# Altium project IoT-Speaker-v1.4.PrjPcb (part 1 of 3)
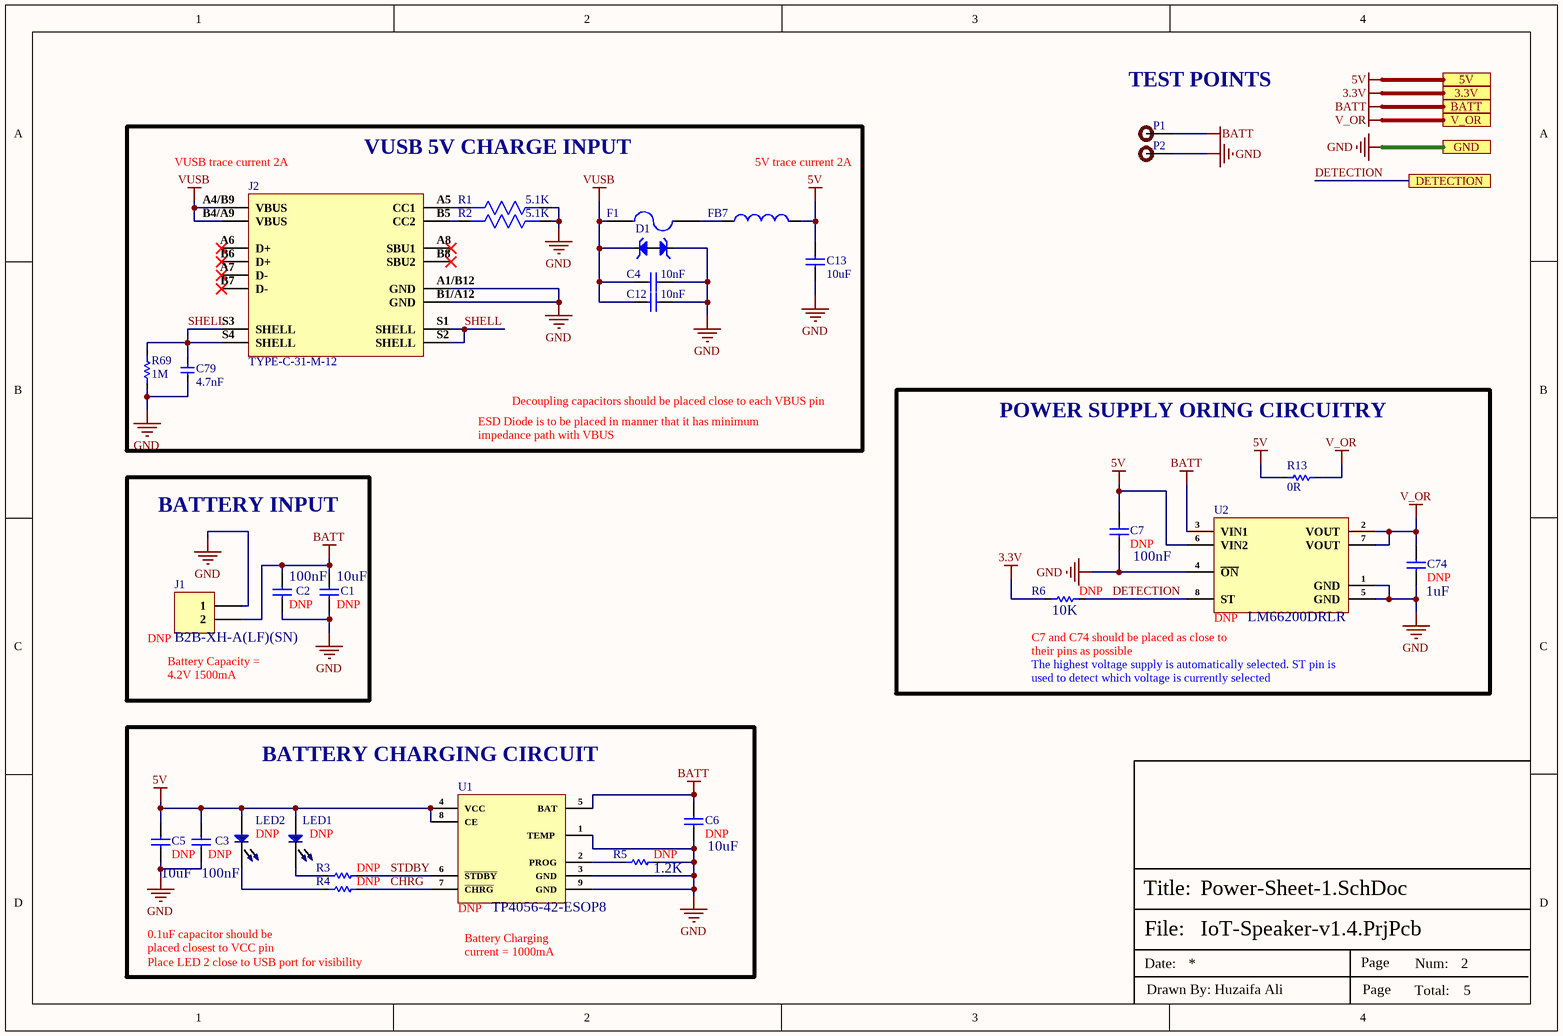
[diagram p0: Power-Sheet-1.SchDoc]
4 sheets, 113 parts. Net scope: strictly hierarchical (ports join the sheet entries above them; power ports are local).
Board file: IOT_Speaker-PCB-v1.4.PcbDoc
Sheets:
  Power-Sheet-1.SchDoc
  Power-Sheet-2.SchDoc
  Controller-Sheet.SchDoc
  Audio-Amplifier.SchDoc

## Sheet Power-Sheet-1.SchDoc
size A4; DocumentNumber: 2; SheetNumber: 2; SheetTotal: 5

### Parts
C1  DNP  [Cap-0805]
C2  DNP  [Cap-0402]
C3  DNP  [Cap-0402]
C4  10nF  [Cap-0603]
C5  DNP  [Cap-0805]
C6  DNP  [Cap-0805]
C7  DNP  [Cap-0402]
C12  10nF  [Cap-0603]
C13  10uF  [Cap-0805]
C74  DNP  [Cap-0603]
C79  4.7nF  [Cap-1206]
D1  PESD5V0H1BSFYL  [DSN0603-2]  (value not drawn)
F1  BSMD0805L-200  [Fuse-0805]  (value not drawn)
FB7  100MHz  [IND-1206]  (value not drawn)
J1  DNP  [B2B-XH-A(LF)(SN)_]
J2  TYPE-C-31-M-12  [TYPE-C-31-M-12_]
LED1  DNP  [LED-0603]
LED2  DNP  [LED-0603]
P1  TEST POINT  [Test-point]  (value not drawn)  (no BOM)
P2  TEST POINT  [Test-point]  (value not drawn)  (no BOM)
R1  5.1K  [Res-0603]
R2  5.1K  [Res-0603]
R3  DNP  [Res-0603]  (no BOM)
R4  DNP  [Res-0603]
R5  DNP  [Res-0603]
R6  DNP  [Res-0603]
R13  0R  [Res-0603]
R69  1M  [Res-0603]
U1  DNP  [ESOP-8]
U2  DNP  [SOT-583]

### Blocks framed on the sheet
VUSB 5V CHARGE INPUT: C4 C12 C13 C79 D1 F1 FB7 J2 R1 R2 R69
POWER SUPPLY ORING CIRCUITRY: C7 C74 R6 R13 U2
BATTERY INPUT: C1 C2 J1
BATTERY CHARGING CIRCUIT: C3 C5 C6 LED1 LED2 R3-R5 U1

### Ports
3.3V, 5V, BATT, DETECTION, GND, V_OR

### Nets
3.3V: R6.1 ; port 3.3V
5V: C3.2 C5.2 C7.2 C13.2 FB7.2 LED1.1 LED2.1 R13.1 U1.4(VCC) U1.8(CE) U2.6(VIN2) ; port 5V
BATT: C1.2 C2.2 C6.2 J1.2 P1.1 U1.5(BAT) U2.3(VIN1) ; port BATT
GND: C1.1 C2.1 C3.1 C4.2 C5.1 C6.1 C7.1 C12.2 C13.1 C74.1 C79.1 D1.2 J1.1 J2.A1/B12(GND) J2.B1/A12(GND) P2.1 R1.1 R2.1 R5.1 R69.1 U1.1(TEMP) U1.3(GND) U1.9(GND) U2.1(GND) U2.4(~{ON}) U2.5(GND) ; port GND
V_OR: C74.2 R13.2 U2.2(VOUT) U2.7(VOUT) ; port V_OR
VUSB: C4.1 C12.1 D1.1 F1.1 J2.A4/B9(VBUS) J2.B4/A9(VBUS)
CHRG: R4.2 U1.7(~{CHRG})
DETECTION: R6.2 U2.8(ST) ; port DETECTION
SHELL: C79.2 J2.S1(SHELL) J2.S2(SHELL) J2.S3(SHELL) J2.S4(SHELL) R69.2
STDBY: R3.2 U1.6(~{STDBY})
NetF1_2: F1.2 FB7.1
NetJ2_A5: J2.A5(CC1) R1.2
NetJ2_B5: J2.B5(CC2) R2.2
NetLED1_2: LED1.2 R3.1
NetLED2_2: LED2.2 R4.1
NetR5_2: R5.2 U1.2(PROG)

Not connected (* = marked no-connect by the designer): J2 A6(D+)* A7(D-)* A8(SBU1)* B6(D+)* B7(D-)* B8(SBU2)*

### Notes on the sheet
- TEST POINTS
- (near J2) VUSB trace current 2A
- 5V trace current 2A
- ESD Diode is to be placed in manner that it has minimum impedance path with VBUS
- Decoupling capacitors should be placed close to each VBUS pin
- 100nF
- (near C1) 10uF
- (near C7) 100nF
- (near J1) B2B-XH-A(LF)(SN)
- C7 and C74 should be placed as close to their pins as possible
- (near R6) 10K
- (near U2) LM66200DRLR
- (near C74) 1uF
- (near J1) Battery Capacity = 4.2V 1500mA
- The highest voltage supply is automatically selected. ST pin is used to detect which voltage is currently selected
- (near C6) 10uF
- 10uF
- (near LED2) 100nF
- (near U1) TP4056-42-ESOP8
- (near R5) 1.2K
- 0.1uF capacitor should be placed closest to VCC pin
- Place LED 2 close to USB port for visibility
- (near U1) Battery Charging current = 1000mA
- File:
- Title:
- Date:
- Page
- Num:
- Total:
- Drawn By: Huzaifa Ali

### Library data of the parts
C1 C13 = CC0805KKX5R8BB106: CAP CER 10UF 25V X5R 0805; Manufacturer: Yageo; Tolerance: 10%; Supplier 1: Digi-Key; Manufacturer Part Number: CC0805KKX5R8BB106; RoHS: Yes; Category: Ceramic Capacitors; Stock 1: 554290; Pricing 1: 1=0.31000, 10=0.21200, 50=0.14820, 100=0.12710, 500=0.09534, 1000=0.08050 (USD); Mount: Surface Mount; Case/Package: 0805; Case Code (Imperial): 0805; Case Code (Metric): 2012; Weight: 0.000194oz; Min Operating Temperature: -55°C; Max Operating Temperature: 85°C; Capacitance: 10uF; Voltage Rating (DC): 25V; Packaging: Tape and Reel; Voltage Rating: 25V; Dielectric: X5R; Termination: SMD/SMT; Resistor Type: Ceramic; Series: CC; Length: 0.079inch; Width: 0.049inch; Thickness: 0.057inch; Depth: 1.25mm; Lead Free: Lead Free; Halogen Free: Halogen Free; RoHS Compliant: Yes; ComponentLink1URL: http://www.mouser.com/ds/2/447/UPY-GPHC_X5R_4V-to-50V_25-1131599.pdf?src-supplier=Mouser; ComponentLink1Description: http://www.mouser.com/ds/2/447/UPY-GPHC_X5R_4V-to-50V_25-1131599.pdf?src-supplier=Mouser; ComponentLink2URL: http://www.yageo.com/documents/recent/UPY-GPHC_X5R_4V-to-50V_25.pdf?src-supplier=Digi-Key; ComponentLink2Description: http://www.yageo.com/documents/recent/UPY-GPHC_X5R_4V-to-50V_25.pdf?src-supplier=Digi-Key; Supplier Part Number 1: 311-1869-1-ND; LCSC Part Number: C89831
C2 C3 C7 = CC0402KRX5R8BB104: CAP CER 0.1UF 25V X5R 0402; Manufacturer: Yageo; Tolerance: 10%; Capacitance: 100nF; Item Type: Capacitor; Supplier 1: Digi-Key; Manufacturer Part Number: CC0402KRX5R8BB104; RoHS: Yes; Category: Ceramic Capacitors; Stock 1: 4598218; Pricing 1: 1=0.10000, 10=0.03800, 50=0.02100, 100=0.01710, 500=0.01224, 1000=0.00961, 2500=0.00874, 5000=0.00804 (USD); Mount: Surface Mount; Case/Package: 0402; Case Code (Metric): 1005; Case Code (Imperial): 0402; Min Operating Temperature: -55°C; Max Operating Temperature: 85°C; Voltage Rating: 25V; Packaging: Tape and Reel; Voltage Rating (DC): 25V; Dielectric: X5R; Resistor Type: Ceramic; Series: CC; Length: 0.039inch; Width: 0.02inch; Thickness: 0.022inch; Depth: 0.5mm; Lead Free: Lead Free; Halogen Free: Halogen Free; RoHS Compliant: Yes; ComponentLink1URL: http://www.mouser.com/ds/2/447/UPY-GPHC_X5R_4V-to-50V_25-1131599.pdf?src-supplier=Mouser; ComponentLink1Description: http://www.mouser.com/ds/2/447/UPY-GPHC_X5R_4V-to-50V_25-1131599.pdf?src-supplier=Mouser; ComponentLink2URL: http://www.yageo.com/documents/recent/UPY-GPHC_X5R_4V-to-50V-16.pdf?src-supplier=Future+Electronics; ComponentLink2Description: http://www.yageo.com/documents/recent/UPY-GPHC_X5R_4V-to-50V-16.pdf?src-supplier=Future+Electronics; ComponentLink3URL: http://www.yageo.com/documents/recent/UPY-GPHC_X5R_4V-to-50V_25.pdf?src-supplier=Digi-Key; ComponentLink3Description: http://www.yageo.com/documents/recent/UPY-GPHC_X5R_4V-to-50V_25.pdf?src-supplier=Digi-Key; Supplier Part Number 1: 311-1697-1-ND; LCSC Part Number: C106256
C4 C12 = CC0603JRNPO9BN103: CAP CER 10000PF 50V C0G/NPO 0603; Manufacturer: Yageo; Tolerance: 5%; Item Type: Capacitor; Supplier 1: Arrow Electronics; Manufacturer Part Number: CC0603JRNPO9BN103; RoHS: Yes; Category: Ceramic Capacitors; Stock 1: 5425; Pricing 1: 1=0.42340, 10=0.29770, 25=0.25590, 100=0.19550, 250=0.19360, 500=0.14320, 1000=0.12060, 3000=0.11930 (USD); Mount: Surface Mount; Case/Package: 0603; Min Operating Temperature: -55°C; Max Operating Temperature: 125°C; Packaging: Tape and Reel; Capacitance: 10nF; Voltage Rating: 50V; Length: 0.063inch; Width: 0.031inch; Thickness: 0.035inch; RoHS Compliant: Yes; ComponentLink1URL: http://www.yageo.com/documents/recent/UPY-GP_NP0_16V-to-50V_16.pdf?src-supplier=Digi-Key; ComponentLink1Description: http://www.yageo.com/documents/recent/UPY-GP_NP0_16V-to-50V_16.pdf?src-supplier=Digi-Key; ComponentLink2URL: http://www.yageo.com/exep/pages/download/literatures/ProductSelectionGuide%202014_Final_2.pdf?src-supplier=Digi-Key; ComponentLink2Description: http://www.yageo.com/exep/pages/download/literatures/ProductSelectionGuide%202014_Final_2.pdf?src-supplier=Digi-Key; Supplier Part Number 1: CC0603JRNPO9BN103; LCSC Part Number: C389113
C5 C6 = CC0805KKX5R8BB106: CAP CER 10UF 25V X5R 0805; Manufacturer: Yageo; Tolerance: 10%; Item Type: Capacitor; Supplier 1: Digi-Key; Manufacturer Part Number: CC0805KKX5R8BB106; RoHS: Yes; Category: Ceramic Capacitors; Stock 1: 554290; Pricing 1: 1=0.31000, 10=0.21200, 50=0.14820, 100=0.12710, 500=0.09534, 1000=0.08050 (USD); Mount: Surface Mount; Case/Package: 0805; Case Code (Imperial): 0805; Case Code (Metric): 2012; Weight: 0.000194oz; Min Operating Temperature: -55°C; Max Operating Temperature: 85°C; Capacitance: 10uF; Voltage Rating (DC): 25V; Packaging: Tape and Reel; Voltage Rating: 25V; Dielectric: X5R; Termination: SMD/SMT; Resistor Type: Ceramic; Series: CC; Length: 0.079inch; Width: 0.049inch; Thickness: 0.057inch; Depth: 1.25mm; Lead Free: Lead Free; Halogen Free: Halogen Free; RoHS Compliant: Yes; ComponentLink1URL: http://www.mouser.com/ds/2/447/UPY-GPHC_X5R_4V-to-50V_25-1131599.pdf?src-supplier=Mouser; ComponentLink1Description: http://www.mouser.com/ds/2/447/UPY-GPHC_X5R_4V-to-50V_25-1131599.pdf?src-supplier=Mouser; ComponentLink2URL: http://www.yageo.com/documents/recent/UPY-GPHC_X5R_4V-to-50V_25.pdf?src-supplier=Digi-Key; ComponentLink2Description: http://www.yageo.com/documents/recent/UPY-GPHC_X5R_4V-to-50V_25.pdf?src-supplier=Digi-Key; Supplier Part Number 1: 311-1869-1-ND; LCSC Part Number: C89831
C74 = CC0603KRX5R8BB105: CAP CER 1UF 25V X5R 0603; Manufacturer: Yageo; Tolerance: 10%; Item Type: Capacitor; Supplier 1: Digi-Key; Manufacturer Part Number: CC0603KRX5R8BB105; RoHS: Yes; Category: Ceramic Capacitors; Stock 1: 919939; Pricing 1: 1=0.12000, 10=0.08400, 50=0.04760, 100=0.03940, 500=0.02764, 1000=0.02288 (USD); Mount: Surface Mount; Case/Package: 0603; Number of Pins: 2; Case Code (Metric): 1608; Case Code (Imperial): 0603; Min Operating Temperature: -55°C; Max Operating Temperature: 85°C; Capacitance: 1uF; Dielectric: X5R; Package Quantity: 1; Voltage Rating: 25V; Packaging: Tape and Reel; Termination: SMD/SMT; Voltage Rating (DC): 25V; Series: CC; Construction: Flat; Length: 1.6mm; Width: 0.031inch; Height: 0.8mm; Thickness: 0.035inch; Depth: 0.8mm; Radiation Hardening: No; REACH SVHC: No SVHC; Lead Free: Lead Free; Halogen Free: Halogen Free; RoHS Compliant: Yes; ComponentLink1URL: https://datasheet.ciiva.com/176/mlccorderingcode-176785.pdf?src-supplier=Digi-Key; ComponentLink1Description: https://datasheet.ciiva.com/176/mlccorderingcode-176785.pdf?src-supplier=Digi-Key; ComponentLink2URL: https://datasheet.ciiva.com/176/mlccorderingcode-176786.pdf?src-supplier=Digi-Key; ComponentLink2Description: https://datasheet.ciiva.com/176/mlccorderingcode-176786.pdf?src-supplier=Digi-Key; ComponentLink3URL: https://datasheet.ciiva.com/176/mlccorderingcode-176787.pdf?src-supplier=Digi-Key; ComponentLink3Description: https://datasheet.ciiva.com/176/mlccorderingcode-176787.pdf?src-supplier=Digi-Key; ComponentLink4URL: https://datasheet.ciiva.com/17436/upy-gphc-x5r-4v-to-50v-12-17436952.pdf?src-supplier=Avnet+Europe; ComponentLink4Description: https://datasheet.ciiva.com/17436/upy-gphc-x5r-4v-to-50v-12-17436952.pdf?src-supplier=Avnet+Europe; ComponentLink5URL: https://datasheet.ciiva.com/7978/1525783-7978171.pdf?src-supplier=Element14; ComponentLink5Description: https://datasheet.ciiva.com/7978/1525783-7978171.pdf?src-supplier=Element14; ComponentLink6URL: https://datasheet.ciiva.com/11586/upy-gphc-x5r-4v-to-50v-12-11586318.pdf?src-supplier=Avnet; ComponentLink6Description: https://datasheet.ciiva.com/11586/upy-gphc-x5r-4v-to-50v-12-11586318.pdf?src-supplier=Avnet; Supplier Part Number 1: 311-1445-1-ND; LCSC Part Number: C14664
C79 = CC1206KKX7RCBB472: CAP CER 4700PF 1KV X7R 1206; Manufacturer: Yageo; Dielectric Material: Ceramic; Tolerance: 10%; Item Type: Capacitor; Supplier 1: Future Electronics; Manufacturer Part Number: CC1206KKX7RCBB472; RoHS: Yes; Category: Ceramic Capacitors; Stock 1: 180000; Pricing 1: 3000=0.02860, 9000=0.02750, 15000=0.02700, 45000=0.02600, 75000=0.02510 (USD); Mount: Surface Mount; Case/Package: 1206; Number of Pins: 2; Case Code (Imperial): 1206; Case Code (Metric): 3216; Weight: 0.000571oz; Min Operating Temperature: -55°C; Max Operating Temperature: 125°C; Voltage Rating: 1kV; Capacitance: 4.7nF; Packaging: Tape and Reel; Voltage Rating (DC): 1kV; Dielectric: X7R; Termination: SMD/SMT; Resistor Type: Ceramic; Series: CC; Length: 3.2mm; Width: 0.063inch; Thickness: 0.057inch; Depth: 1.6mm; Radiation Hardening: No; Lead Free: Lead Free; RoHS Compliant: Yes; ComponentLink1URL: https://datasheet.ciiva.com/13208/upy-gp-np0-16v-to-50v-8-13208693.pdf?src-supplier=Mouser; ComponentLink1Description: https://datasheet.ciiva.com/13208/upy-gp-np0-16v-to-50v-8-13208693.pdf?src-supplier=Mouser; ComponentLink2URL: https://datasheet.ciiva.com/11466/hv-11466701.pdf?src-supplier=Avnet; ComponentLink2Description: https://datasheet.ciiva.com/11466/hv-11466701.pdf?src-supplier=Avnet; Supplier Part Number 1: 7130131; LCSC Part Number: C107198
D1 = PESD5V0H1BSFYL: TVS DIODE 5VWM 6.3VC DSN0603-2; Manufacturer: Nexperia; Supplier 1: Avnet; Manufacturer Part Number: PESD5V0H1BSFYL; RoHS: Yes; Category: ESD and Circuit Protection ICs; Stock 1: 9000; Pricing 1: 18000=0.06453, 36000=0.06278, 54000=0.06104, 90000=0.05930, 180000=0.05755, 900000=0.05581, 1800000=0.05406 (USD); RoHS Compliant: Yes; ComponentLink1URL: http://www.farnell.com/datasheets/1961312.pdf?src-supplier=Farnell; ComponentLink1Description: http://www.farnell.com/datasheets/1961312.pdf?src-supplier=Farnell; ComponentLink2URL: https://assets.nexperia.com/documents/data-sheet/PESD5V0H1BSF.pdf?src-supplier=Digi-Key; ComponentLink2Description: https://assets.nexperia.com/documents/data-sheet/PESD5V0H1BSF.pdf?src-supplier=Digi-Key; ComponentLink3URL: http://www.farnell.com/datasheets/1961312.pdf?src-supplier=Newark; ComponentLink3Description: http://www.farnell.com/datasheets/1961312.pdf?src-supplier=Newark; Supplier Part Number 1: PESD5V0H1BSFYL; LCSC Part Number: C477989; Item Type: Diode
F1 = BSMD0805L-200: 6V 2A 50A 1W -40℃~+85℃ 4A 4mΩ 5s 45mΩ 0805 Resettable Fuses ROHS; Manufacturer: BHFUSE; Item Type: Fuse; Manufacturer Part Number: BSMD0805L-200; Package: 0805; LCSC Part Number: C2757931; ComponentLink1Description: LCSC; ComponentLink1URL: https://www.lcsc.com/product-detail/Resettable-Fuses_BHFUSE-BSMD0805L-200_C2757931.html
FB7 = BLM31PG121SN1L: FERRITE BEAD 120 OHM 1206 1LN; Manufacturer: Murata; Material: Steel,Ferrite; Tolerance: 25%; Impedance: 120R; Max Current Rating: 3.5A; Number of Lines: 1; DC Resistance (DCR): 20mR; Max DC Current: 3A; Shielding: Unshielded; Supplier 1: Avnet; Manufacturer Part Number: BLM31PG121SN1L; RoHS: Yes; Category: Ferrite Beads and Chips; Stock 1: 290640; Pricing 1: 3000=0.11563, 6000=0.10938, 12000=0.10313, 18000=0.09688, 24000=0.09063, 30000=0.08438, 300000=0.07813 (USD); Case/Package: 1206; Number of Pins: 2; Core Material: Ferrite; Case Code (Metric): 3216; Case Code (Imperial): 1206; Contact Plating: Tin,Matte; Min Operating Temperature: -55°C; Max Operating Temperature: 125°C; Package Quantity: 3000; Packaging: Tape and Reel; Current Rating: 3.5A; Termination: SMD/SMT; Test Frequency: 100MHz; DC Current: 3A; Frequency: 100MHz; Length: 3.2mm; Width: 1.6mm; Height: 1.1mm; Depth: 1.6mm; Radiation Hardening: No; Military Standard: Not; Lead Free: Lead Free; RoHS Compliant: Yes; ComponentLink1URL: https://datasheet.ciiva.com/19460/1845419-19460234.pdf?src-supplier=Jameco; ComponentLink1Description: https://datasheet.ciiva.com/19460/1845419-19460234.pdf?src-supplier=Jameco; ComponentLink2URL: https://datasheet.ciiva.com/1012/l0132s0193blm31p-1012992.pdf?src-supplier=Digi-Key; ComponentLink2Description: https://datasheet.ciiva.com/1012/l0132s0193blm31p-1012992.pdf?src-supplier=Digi-Key; ComponentLink3URL: https://datasheet.ciiva.com/11799/0900766b811b5866-11799444.pdf?src-supplier=RSComponents; ComponentLink3Description: https://datasheet.ciiva.com/11799/0900766b811b5866-11799444.pdf?src-supplier=RSComponents; ComponentLink4URL: https://datasheet.ciiva.com/3081/l0110s0100blm31p-3081665.pdf?src-supplier=Avnet; ComponentLink4Description: https://datasheet.ciiva.com/3081/l0110s0100blm31p-3081665.pdf?src-supplier=Avnet; ComponentLink5URL: https://datasheet.ciiva.com/41449/001172383-da-01-en-drossel-1206-120r-3-2x1-60mm-3000st-41449554.pdf?src-supplier=Conrad; ComponentLink5Description: https://datasheet.ciiva.com/41449/001172383-da-01-en-drossel-1206-120r-3-2x1-60mm-3000st-41449554.pdf?src-supplier=Conrad; ComponentLink6URL: https://datasheet.ciiva.com/29348/442557-da-01-en-chip-drossel-1206-120r-3000ma-3-2x1-60mm-29348014.pdf?src-supplier=Conrad; ComponentLink6Description: https://datasheet.ciiva.com/29348/442557-da-01-en-chip-drossel-1206-120r-3000ma-3-2x1-60mm-29348014.pdf?src-supplier=Conrad; ComponentLink7URL: https://datasheet.ciiva.com/14122/apblm31p-data-e-14122856.pdf?src-supplier=Distrelec; ComponentLink7Description: https://datasheet.ciiva.com/14122/apblm31p-data-e-14122856.pdf?src-supplier=Distrelec; ComponentLink8URL: https://datasheet.ciiva.com/48436/blm31pg121sn1l-eng-tds-48436731.pdf?src-supplier=Distrelec; ComponentLink8Description: https://datasheet.ciiva.com/48436/blm31pg121sn1l-eng-tds-48436731.pdf?src-supplier=Distrelec; ComponentLink9URL: https://datasheet.ciiva.com/1012/l0110s0100blm31p-1012991.pdf?src-supplier=Digi-Key; ComponentLink9Description: https://datasheet.ciiva.com/1012/l0110s0100blm31p-1012991.pdf?src-supplier=Digi-Key; ComponentLink10URL: https://datasheet.ciiva.com/1012/l0110s0100blm31p-1012993.pdf?src-supplier=Digi-Key; ComponentLink10Description: https://datasheet.ciiva.com/1012/l0110s0100blm31p-1012993.pdf?src-supplier=Digi-Key; ComponentLink11URL: https://datasheet.ciiva.com/3081/l0110s0100blm31p-3081666.pdf?src-supplier=Avnet; ComponentLink11Description: https://datasheet.ciiva.com/3081/l0110s0100blm31p-3081666.pdf?src-supplier=Avnet; ComponentLink12URL: https://datasheet.ciiva.com/16390/l0110s0100blm31p-16390857.pdf?src-supplier=Future+Electronics; ComponentLink12Description: https://datasheet.ciiva.com/16390/l0110s0100blm31p-16390857.pdf?src-supplier=Future+Electronics; ComponentLink13URL: https://datasheet.ciiva.com/18093/getdatasheetpartid-152966-18093084.pdf?src-supplier=Verical; ComponentLink13Description: https://datasheet.ciiva.com/18093/getdatasheetpartid-152966-18093084.pdf?src-supplier=Verical; Supplier Part Number 1: BLM31PG121SN1L; LCSC Part Number: C85841; Item Type: Ferrite Bead
J1 = B2B-XH-A(LF)(SN): Conn Shrouded Header (4 Sides) HDR 2 POS 2.5mm Solder ST Thru-Hole Box; Manufacturer: JST; Number of Positions: 2; Connector Type: Male Pin; Current Rating: 3A; Contact Resistance: 20mR; Voltage Rating: 250V; Insulation Resistance: 1GR; Wire/Cable Gauge: 22AWG; Item Type: JST Connector; Supplier 1: Farnell; Manufacturer Part Number: B2B-XH-A(LF)(SN); RoHS: Yes; Category: FFC / FPC; Stock 1: 219240; Pricing 1: 100=0.06860, 1000=0.04800, 2500=0.04520, 5000=0.04230, 10000=0.03950, 20000=0.03660 (GBP); Mount: Through Hole; Contact Plating: Tin,Copper,Lead; Color: Natural; Contact Material: Brass; Housing Color: White; Housing Material: Polyamide; Min Operating Temperature: -25°C; Max Operating Temperature: 85°C; Number of Rows: 1; Packaging: Bulk; Termination: Solder; Fastening Type: Detent; Max Current Rating: 3A; Voltage Rating (AC): 250V; Max Voltage Rating (AC): 250V; Number of Contacts: 2; Max Voltage Rating (DC): 250V; Orientation: Straight; Length: 7.4mm; Pitch: 2.5mm; Lead Pitch: 2.5mm; Depth: 5.75mm; REACH SVHC: No SVHC; Lead Free: Lead Free; ComponentLink1URL: https://datasheet.ciiva.com/26894/getdatasheetpartid-640357-26894434.pdf?src-supplier=Verical; ComponentLink1Description: https://datasheet.ciiva.com/26894/getdatasheetpartid-640357-26894434.pdf?src-supplier=Verical; ComponentLink2URL: https://datasheet.ciiva.com/11746/0900766b8082653e-11746979.pdf?src-supplier=RSComponents; ComponentLink2Description: https://datasheet.ciiva.com/11746/0900766b8082653e-11746979.pdf?src-supplier=RSComponents; ComponentLink3URL: https://datasheet.ciiva.com/26894/getdatasheetpartid-385291-26894760.pdf?src-supplier=Verical; ComponentLink3Description: https://datasheet.ciiva.com/26894/getdatasheetpartid-385291-26894760.pdf?src-supplier=Verical; ComponentLink4URL: https://datasheet.ciiva.com/8052/5448-8052024.pdf?src-supplier=Element14; ComponentLink4Description: https://datasheet.ciiva.com/8052/5448-8052024.pdf?src-supplier=Element14; ComponentLink5URL: https://datasheet.ciiva.com/20207/523653-20207167.pdf?src-supplier=Rapid+Electronics; ComponentLink5Description: https://datasheet.ciiva.com/20207/523653-20207167.pdf?src-supplier=Rapid+Electronics; Supplier Part Number 1: 1516276; LCSC Part Number: C158012
J2 = TYPE-C-31-M-12: 250mA 1 16 Female Type-C SMD USB Connectors ROHS; Manufacturer: Korean Hroparts Elec; ComponentLink1Description: LCSC; ComponentLink1URL: https://www.lcsc.com/product-detail/USB-Connectors_Korean-Hroparts-Elec-TYPE-C-31-M-12_C165948.html; Manufacturer Part Number: TYPE-C-31-M-12; Footprint: Custom; LCSC Part Number: C165948; Item Type: USB Connector
LED1 = NCD0603G2: Emerald 0603 Light Emitting Diodes (LED) ROHS; Manufacturer: Foshan NationStar Optoelectronics; Manufacturer Part Number: NCD0603G2; Package: 0603; LCSC Part Number: C87326; Item Type: LED; ComponentLink1Description: LCSC; ComponentLink1URL: https://www.lcsc.com/product-detail/Light-Emitting-Diodes-LED_Foshan-NationStar-Optoelectronics-NCD0603G2_C87326.html
LED2 = NCD0603R3: 0603 Light Emitting Diodes (LED) ROHS; Manufacturer: Foshan NationStar Optoelectronics; Manufacturer Part Number: NCD0603R3; Package: 0603; Item Type: LED; LCSC Part Number: C3151730; ComponentLink1Description: LCSC; ComponentLink1URL: https://www.lcsc.com/product-detail/Light-Emitting-Diodes-LED_Foshan-NationStar-Optoelectronics-NCD0603R3_C3151730.html
P1 P2 = TEST POINT: Test Point ON; Item Type: TEST POINT
R1 R2 = RC0603FR-075K1L: RES 5.1K OHM 1% 1/10W 0603; Manufacturer: Yageo; Power Rating: 100mW; Temperature Coefficient: 100ppm/°C; Resistance: 5.1kR; Voltage Rating: 50V; Item Type: Resistor; Supplier 1: Avnet; Manufacturer Part Number: RC0603FR-075K1L; RoHS: Yes; Category: Chip SMD Resistors; Stock 1: 100000; Pricing 1: 5000=0.00133, 10000=0.00131, 20000=0.00127 (USD); Case/Package: 0603; Number of Pins: 2; Case Code (Imperial): 0603; Case Code (Metric): 1608; Size Code: 0603; Min Operating Temperature: -55°C; Max Operating Temperature: 155°C; Tolerance: 1%; Series: RC; Packaging: Tape and Reel; Package Quantity: 1; Termination: SMD/SMT; Resistor Type: Thick Film; Number of Terminations: 2; Max Power Dissipation: 100mW; Voltage Rating (DC): 50V; Features: Moisture Resistant; Resistance Tolerance: 1%; Construction: Rectangular; Length: 0.063inch; Width: 0.031inch; Height: 0.022inch; Depth: 0.8mm; RoHS Compliant: Yes; Reach SVHC Compliant: Yes; Military Standard: Not; Lead Free: Lead Free; ComponentLink1URL: https://datasheet.ciiva.com/46395/443971-46395016.pdf?src-supplier=Element14; ComponentLink1Description: https://datasheet.ciiva.com/46395/443971-46395016.pdf?src-supplier=Element14; ComponentLink2URL: https://datasheet.ciiva.com/2454/pyu-r-int-thick-7-2454046.pdf?src-supplier=Digi-Key; ComponentLink2Description: https://datasheet.ciiva.com/2454/pyu-r-int-thick-7-2454046.pdf?src-supplier=Digi-Key; ComponentLink3URL: https://datasheet.ciiva.com/2454/pyu-r-int-thick-7-2454047.pdf?src-supplier=Digi-Key; ComponentLink3Description: https://datasheet.ciiva.com/2454/pyu-r-int-thick-7-2454047.pdf?src-supplier=Digi-Key; ComponentLink4URL: https://datasheet.ciiva.com/2454/pyu-r-int-thick-7-2454045.pdf?src-supplier=Digi-Key; ComponentLink4Description: https://datasheet.ciiva.com/2454/pyu-r-int-thick-7-2454045.pdf?src-supplier=Digi-Key; ComponentLink5URL: https://datasheet.ciiva.com/15189/getdatasheetpartid-326732-15189786.pdf?src-supplier=Verical; ComponentLink5Description: https://datasheet.ciiva.com/15189/getdatasheetpartid-326732-15189786.pdf?src-supplier=Verical; Supplier Part Number 1: RC0603FR-075K1L; LCSC Part Number: C105580
R3 = RC0603FR-07220RL: RES SMD 220 OHM 1% 1/10W 0603; Manufacturer: Yageo; Resistance: 220R; Temperature Coefficient: 100ppm/°C; Voltage Rating (DC): 50V; Power Rating: 100mW; Item Type: Resistor; Supplier 1: Digi-Key; Manufacturer Part Number: RC0603FR-07220RL; Stock 1: 5843995; Pricing 1: 1=0.1, 10=0.023, 100=0.0094, 1000=0.00421, 2500=0.00366 (USD); Case/Package: 0603; Number of Pins: 2; Case Code (Imperial): 0603; Case Code (Metric): 1608; Min Operating Temperature: -55°C; Max Operating Temperature: 155°C; Tolerance: 1%; Composition: Thick Film; Packaging: Tape and Reel; Voltage Rating: 50V; Package Quantity: 1; Termination: SMD/SMT; Number of Terminations: 2; Military Standard: Not; Max Power Dissipation: 100mW; Features: Moisture Resistant; Length: 1.6mm; Height: 0.022inch; Width: 0.031inch; Depth: 0.8mm; REACH SVHC: No SVHC; Lead Free: Lead Free; ComponentLink1URL: http://www.yageo.com/documents/recent/PYu-RC_Group_51_RoHS_L_10.pdf?src-supplier=Digi-Key; ComponentLink1Description: http://www.yageo.com/documents/recent/PYu-RC_Group_51_RoHS_L_10.pdf?src-supplier=Digi-Key; ComponentLink2URL: http://www.farnell.com/datasheets/1868787.pdf?src-supplier=Element14; ComponentLink2Description: http://www.farnell.com/datasheets/1868787.pdf?src-supplier=Element14; Supplier Part Number 1: 311-220HRCT-ND; LCSC Part Number: C107696
R4 = RC0603JR-07330RL: RES  SMD 330R 100 mW 0603; Manufacturer: Yageo; Power Rating: 100mW; Tolerance: 5%; Voltage Rating (DC): 50V; Temperature Coefficient: 100ppm/°C; Item Type: Resistor; Supplier 1: Digi-Key; Manufacturer Part Number: RC0603JR-07330RL; RoHS: Yes; Category: Chip SMD Resistors; Stock 1: 1074593; Pricing 1: 1=0.10000, 10=0.02000, 100=0.00800, 1000=0.00360, 2500=0.00312 (USD); Case/Package: 0603; Number of Pins: 2; Case Code (Imperial): 0603; Case Code (Metric): 1608; Size Code: 0603; Min Operating Temperature: -55°C; Max Operating Temperature: 155°C; Resistance: 330R; Packaging: Tape and Reel; Voltage Rating: 50V; Package Quantity: 5000; Termination: SMD/SMT; Resistor Type: Thick Film; Features: Moisture Resistant; Series: RC; Max Power Dissipation: 100mW; Number of Terminations: 2; Resistance Tolerance: 5%; Construction: Rectangular; Length: 1.6mm; Width: 0.8mm; Height: 0.45mm; Depth: 0.8mm; REACH SVHC: No SVHC; Lead Free: Lead Free; Military Standard: Not; RoHS Compliant: Yes; Supplier Part Number 1: 311-330GRCT-ND; LCSC Part Number: C105879
R5 = 0603WAF1201T5E: Thick Film Resistors 75V 1.2kΩ 0603 Chip Resistor - Surface Mount ROHS; Manufacturer: UNI-ROYAL; Footpint: 0603; Manufacturer Part Number: 0603WAF1201T5E; Value: 1.2kΩ; ComponentLink1Description: LCSC; ComponentLink1URL: https://lcsc.com/product-detail/Chip-Resistor-Surface-Mount_UNI-ROYAL-Uniroyal-Elec-0603WAF1201T5E_C22765.html; LCSC Part Number: C22765; Item Type: Resistor
R6 = RC0603FR-0710KL: RES SMD 10K Ohm 1% 1/10W 0603; Manufacturer: Yageo; Resistance: 10kR; Temperature Coefficient: 100ppm/°C; Voltage Rating (DC): 50V; Power Rating: 100mW; Voltage Rating: 75V; Item Type: Resistor; Supplier 1: Digi-Key; Manufacturer Part Number: RC0603FR-0710KL; RoHS: Yes; Category: Chip SMD Resistors; Stock 1: 25249139; Pricing 1: 1=0.10000, 10=0.02400, 100=0.00970, 1000=0.00436, 2500=0.00378 (USD); Case/Package: 0603; Number of Pins: 2; Case Code (Imperial): 0603; Case Code (Metric): 1608; Weight: 7.1E-05oz; Size Code: 0603; Min Operating Temperature: -55°C; Max Operating Temperature: 155°C; Tolerance: 1%; Resistor Type: Thick Film; Packaging: Tape and Reel; Termination: SMD/SMT; Features: Moisture Resistant; Series: RC; Max Power Dissipation: 100mW; Number of Terminations: 2; Resistance Tolerance: 1%; Construction: Rectangular; Length: 1.6mm; Width: 0.8mm; Height: 0.45mm; Depth: 0.8mm; Lead Pitch: 0.3mm; REACH SVHC: Unknown; Lead Free: Lead Free; Military Standard: Not; RoHS Compliant: Yes; ComponentLink1URL: https://datasheet.ciiva.com/7660/38590-7660789.pdf?src-supplier=Element14; ComponentLink1Description: https://datasheet.ciiva.com/7660/38590-7660789.pdf?src-supplier=Element14; ComponentLink2URL: https://datasheet.ciiva.com/7983/443971-7983596.pdf?src-supplier=Element14; ComponentLink2Description: https://datasheet.ciiva.com/7983/443971-7983596.pdf?src-supplier=Element14; ComponentLink3URL: https://datasheet.ciiva.com/22747/443971-22747519.pdf?src-supplier=Element14; ComponentLink3Description: https://datasheet.ciiva.com/22747/443971-22747519.pdf?src-supplier=Element14; ComponentLink4URL: https://datasheet.ciiva.com/46440/1868787-46440891.pdf?src-supplier=Element14; ComponentLink4Description: https://datasheet.ciiva.com/46440/1868787-46440891.pdf?src-supplier=Element14; ComponentLink5URL: https://datasheet.ciiva.com/7746/1738695-7746239.pdf?src-supplier=Element14; ComponentLink5Description: https://datasheet.ciiva.com/7746/1738695-7746239.pdf?src-supplier=Element14; ComponentLink6URL: https://datasheet.ciiva.com/15189/getdatasheetpartid-409289-15189591.pdf?src-supplier=Verical; ComponentLink6Description: https://datasheet.ciiva.com/15189/getdatasheetpartid-409289-15189591.pdf?src-supplier=Verical; Supplier Part Number 1: 311-10.0KHRCT-ND; LCSC Part Number: C98220
R13 = RC0603JR-070RL: RES 0 OHM JUMPER 1/10W 0603; Manufacturer: Yageo; Resistance: 0mR; Tolerance: 1%; Power Rating: 100mW; Voltage Rating (DC): 50V; Temperature Coefficient: 200ppm/°C; Resistance Tolerance: 5%; Item Type: Resistor; Supplier 1: Digi-Key; Manufacturer Part Number: RC0603JR-070RL; RoHS: Yes; Category: Chip SMD Resistors; Stock 1: 18081776; Pricing 1: 1=0.10000, 10=0.01700, 25=0.01240, 50=0.00960, 100=0.00700, 250=0.00536, 500=0.00430, 1000=0.00316 (USD); Case/Package: 0603; Number of Pins: 2; Contact Plating: Tin,Matte; Case Code (Imperial): 0603; Case Code (Metric): 1608; Size Code: 0603; Min Operating Temperature: -55°C; Max Operating Temperature: 155°C; Resistor Type: Thick Film; Packaging: Tape and Reel; Termination: SMD/SMT; Series: RC; Technology: THICK FILM; Package Quantity: 5000; Voltage Rating: 50V; Features: Moisture Resistant; Max Power Dissipation: 100mW; Number of Terminations: 2; Construction: Rectangular; Length: 1.6mm; Width: 0.8mm; Height: 0.45mm; Depth: 0.8mm; Radiation Hardening: No; Reach SVHC Compliant: No SVHC; Lead Free: Lead Free; RoHS Compliant: Yes; Military Standard: Not; Supplier Part Number 1: 311-0.0GRCT-ND; LCSC Part Number: C95177
R69 = RC0603FR-071ML: RES SMD 1M OHM 1% 1/10W 0603; Manufacturer: Yageo; Voltage Rating: 50V; Resistance: 1MR; Power Rating: 100mW; Temperature Coefficient: 100ppm/°C; Item Type: Resistor; Supplier 1: Digi-Key; Manufacturer Part Number: RC0603FR-071ML; Stock 1: 3824601; Pricing 1: 1=0.1, 10=0.023, 100=0.0094, 1000=0.00421, 2500=0.00366 (USD); Case/Package: 0603; Number of Pins: 2; Case Code (Imperial): 0603; Case Code (Metric): 1608; Min Operating Temperature: -55°C; Max Operating Temperature: 155°C; Voltage Rating (DC): 50V; Tolerance: 1%; Packaging: Tape and Reel; Package Quantity: 5000; Termination: SMD/SMT; Composition: Thick Film; Military Standard: Not; Length: 1.6mm; Height: 0.45mm; Width: 0.8mm; Depth: 0.8mm; REACH SVHC: No SVHC; Lead Free: Lead Free; ComponentLink1URL: http://www.farnell.com/datasheets/2167052.pdf?src-supplier=Mouser; ComponentLink1Description: http://www.farnell.com/datasheets/2167052.pdf?src-supplier=Mouser; ComponentLink2URL: http://www.farnell.com/datasheets/2167052.pdf?src-supplier=Element14; ComponentLink2Description: http://www.farnell.com/datasheets/2167052.pdf?src-supplier=Element14; ComponentLink3URL: http://documents.rs-components.com/techlib://itc_doclist_GB.htm?stockno=5048956&src-supplier=RSComponents; ComponentLink3Description: http://documents.rs-components.com/techlib://itc_doclist_GB.htm?stockno=5048956&src-supplier=RSComponents; Supplier Part Number 1: 311-1.00MHRDKR-ND; LCSC Part Number: C105578
U1 = TP4056-42-ESOP8: ESOP-8 Battery Management ICs ROHS; Manufacturer: TOPPOWER; Item Type: Mosfet; Manufacturer Part Number: TP4056-42-ESOP8; Package: ESOP-8; LCSC Part Number: C16581; ComponentLink1Description: LCSC; ComponentLink1URL: https://www.lcsc.com/product-detail/Battery-Management-ICs_TOPPOWER-Nanjing-Extension-Microelectronics-TP4056-42-ESOP8_C16581.html
U2 = LM66200DRLR: OR Controller N+1 ORing Controller N-Channel 2:1 SOT-583; Manufacturer: Texas Instruments; Item Type: IC; Supplier 1: Mouser; Manufacturer Part Number: LM66200DRLR; RoHS: No; Category: Integrated Circuits (ICs); Stock 1: 11717; Pricing 1: 1=0.80000, 10=0.70000, 50=0.65800, 100=0.53700, 1000=0.34000, 10000=0.30700 (USD); Supplier Part Number 1: 595-LM66200DRLR; LCSC Part Number: C3235556